# EAGLE design 24ch_amp (EAGLE 6.6.0)
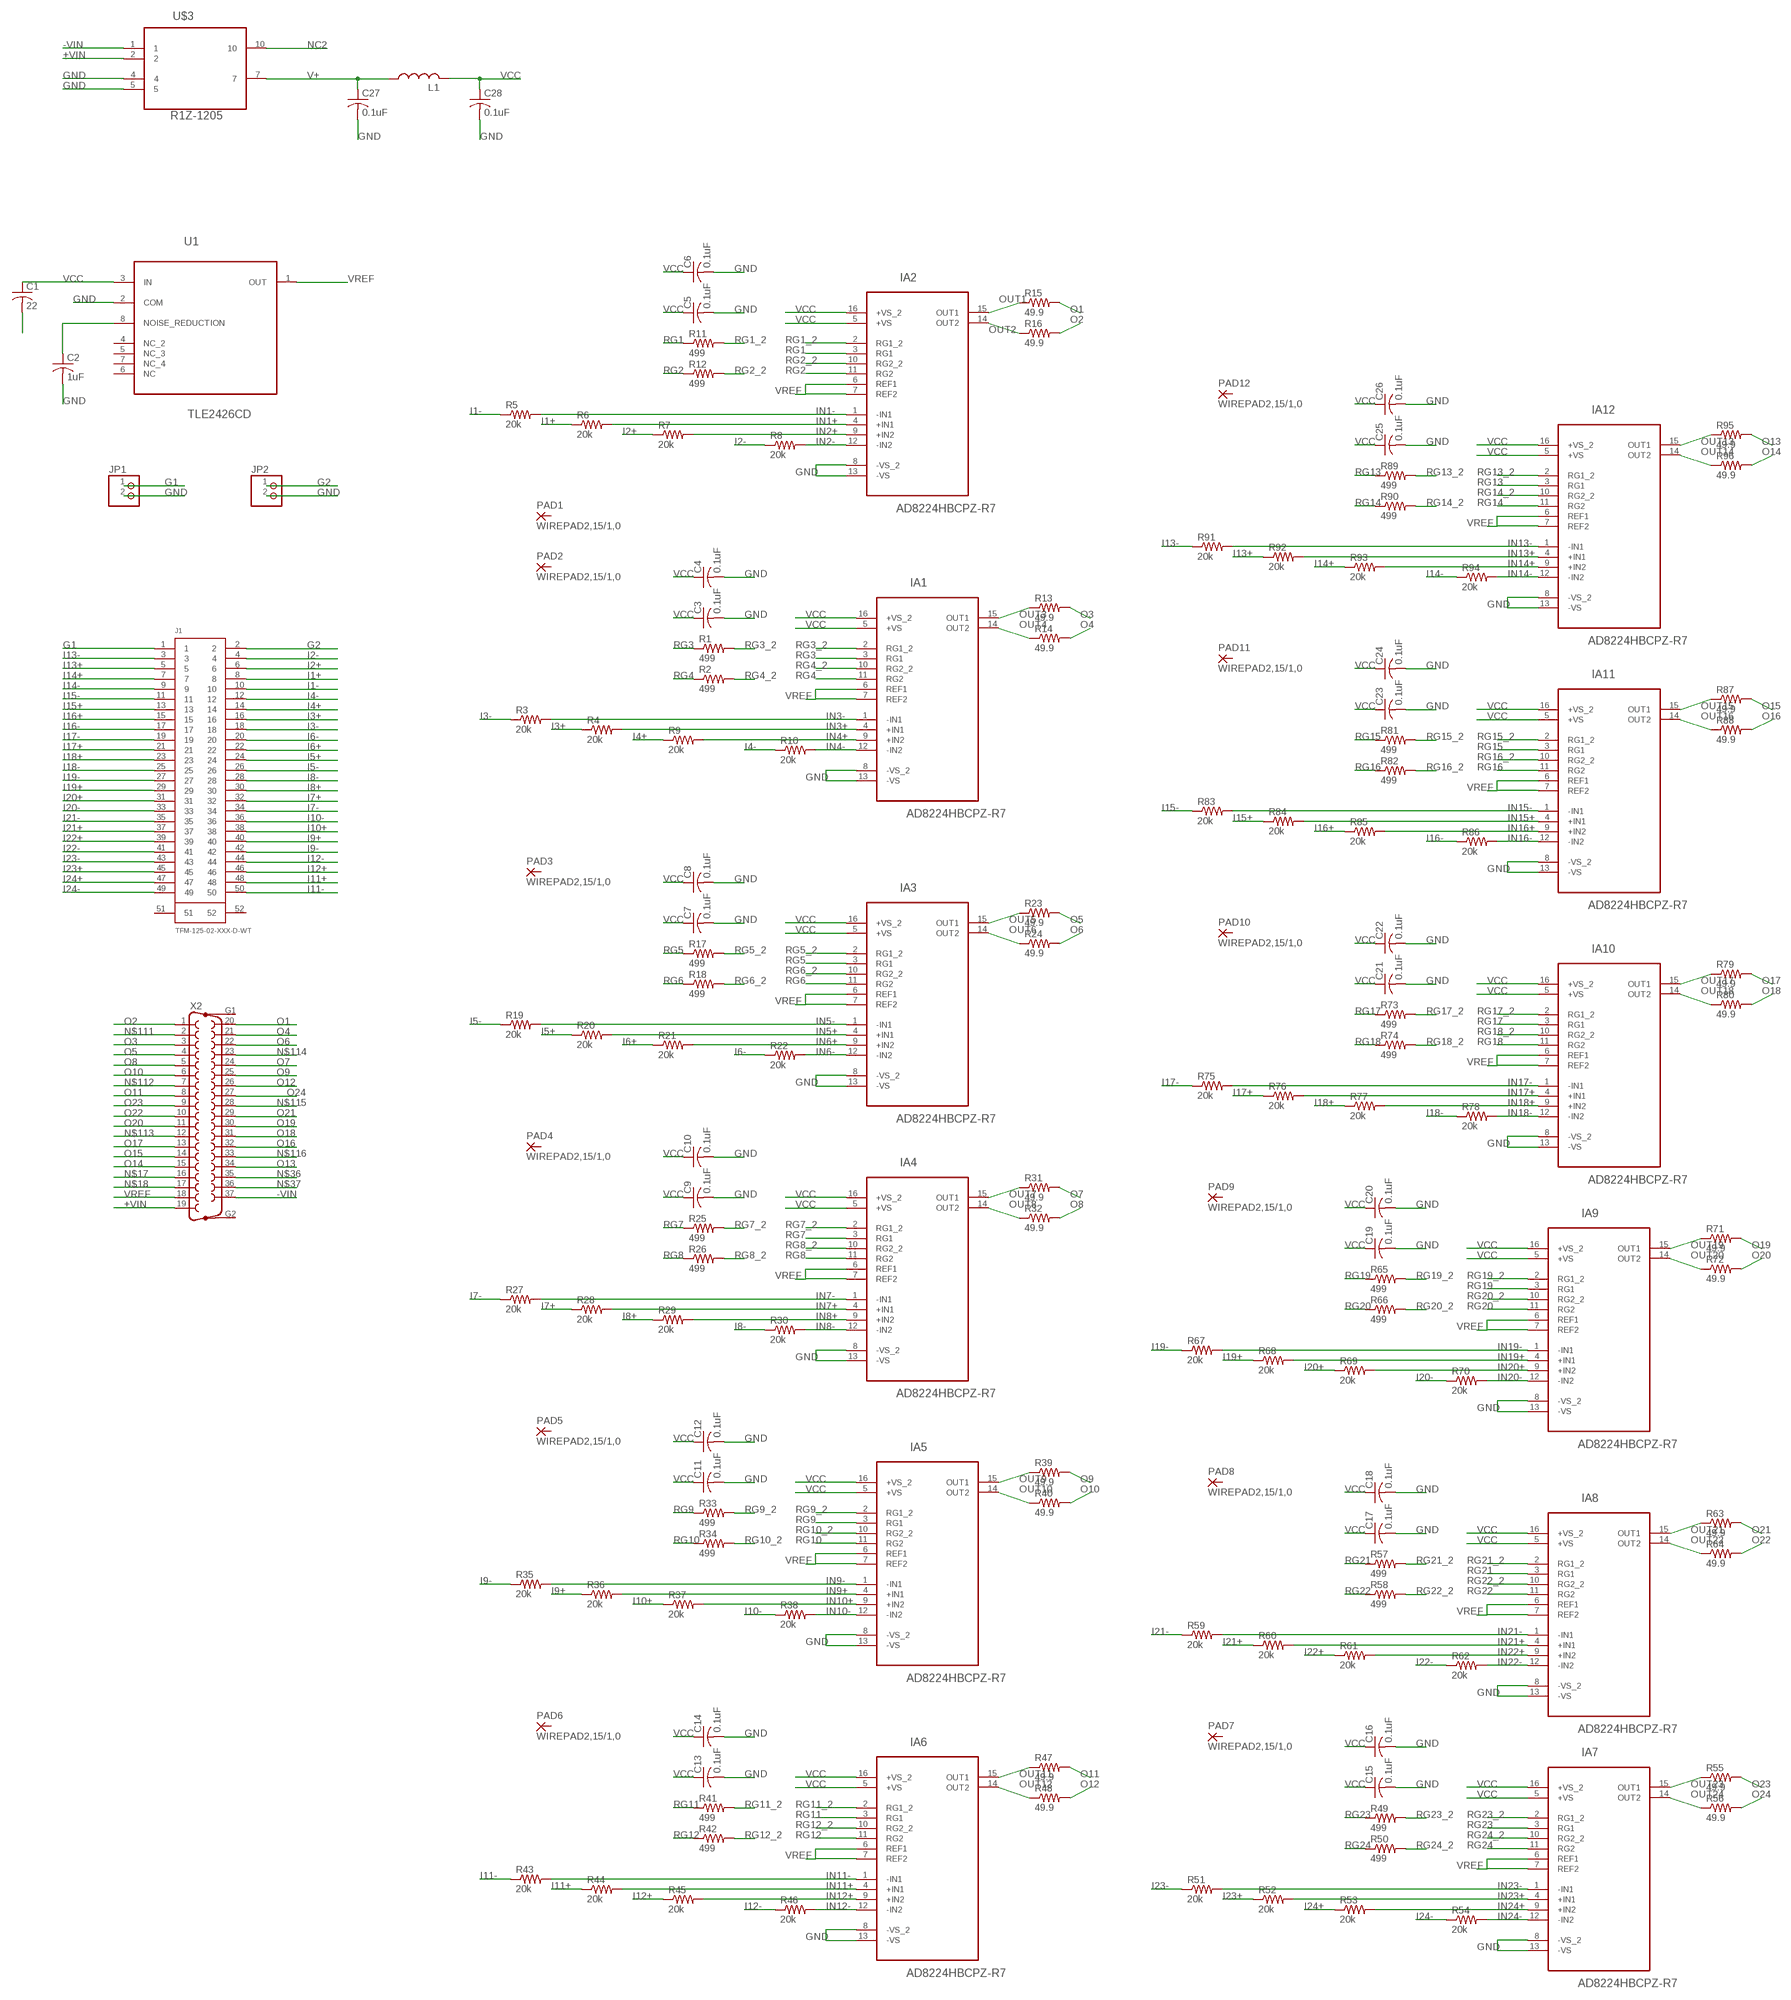
[diagram p0: schematic, sheet 1]

## Parts
C1  22  C-USC0805  [C0805]
C2  1uF  C-USC0805  [C0805]
C3  0.1uF  C-USC0805  [C0805]
C4  0.1uF  C-USC0805  [C0805]
C5  0.1uF  C-USC0805  [C0805]
C6  0.1uF  C-USC0805  [C0805]
C7  0.1uF  C-USC0805  [C0805]
C8  0.1uF  C-USC0805  [C0805]
C9  0.1uF  C-USC0805  [C0805]
C10  0.1uF  C-USC0805  [C0805]
C11  0.1uF  C-USC0805  [C0805]
C12  0.1uF  C-USC0805  [C0805]
C13  0.1uF  C-USC0805  [C0805]
C14  0.1uF  C-USC0805  [C0805]
C15  0.1uF  C-USC0805  [C0805]
C16  0.1uF  C-USC0805  [C0805]
C17  0.1uF  C-USC0805  [C0805]
C18  0.1uF  C-USC0805  [C0805]
C19  0.1uF  C-USC0805  [C0805]
C20  0.1uF  C-USC0805  [C0805]
C21  0.1uF  C-USC0805  [C0805]
C22  0.1uF  C-USC0805  [C0805]
C23  0.1uF  C-USC0805  [C0805]
C24  0.1uF  C-USC0805  [C0805]
C25  0.1uF  C-USC0805  [C0805]
C26  0.1uF  C-USC0805  [C0805]
C27  0.1uF  C-USC0805  [C0805]
C28  0.1uF  C-USC0805  [C0805]
IA1  AD8224HBCPZ-R7  [QFN65P400X400X100-16N]
IA2  AD8224HBCPZ-R7  [QFN65P400X400X100-16N]
IA3  AD8224HBCPZ-R7  [QFN65P400X400X100-16N]
IA4  AD8224HBCPZ-R7  [QFN65P400X400X100-16N]
IA5  AD8224HBCPZ-R7  [QFN65P400X400X100-16N]
IA6  AD8224HBCPZ-R7  [QFN65P400X400X100-16N]
IA7  AD8224HBCPZ-R7  [QFN65P400X400X100-16N]
IA8  AD8224HBCPZ-R7  [QFN65P400X400X100-16N]
IA9  AD8224HBCPZ-R7  [QFN65P400X400X100-16N]
IA10  AD8224HBCPZ-R7  [QFN65P400X400X100-16N]
IA11  AD8224HBCPZ-R7  [QFN65P400X400X100-16N]
IA12  AD8224HBCPZ-R7  [QFN65P400X400X100-16N]
J1  TFM-125-02-XXX-D-WT  [TFM-125-02-XXX-D-WT]
JP1  PINHD-1X2  [1X02]
JP2  PINHD-1X2  [1X02]
L1  L-USL3225M  [L3225M]
PAD1  WIREPAD2,15/1,0  [2,15/1,0]
PAD2  WIREPAD2,15/1,0  [2,15/1,0]
PAD3  WIREPAD2,15/1,0  [2,15/1,0]
PAD4  WIREPAD2,15/1,0  [2,15/1,0]
PAD5  WIREPAD2,15/1,0  [2,15/1,0]
PAD6  WIREPAD2,15/1,0  [2,15/1,0]
PAD7  WIREPAD2,15/1,0  [2,15/1,0]
PAD8  WIREPAD2,15/1,0  [2,15/1,0]
PAD9  WIREPAD2,15/1,0  [2,15/1,0]
PAD10  WIREPAD2,15/1,0  [2,15/1,0]
PAD11  WIREPAD2,15/1,0  [2,15/1,0]
PAD12  WIREPAD2,15/1,0  [2,15/1,0]
R1  499  R-US_R0805  [R0805]
R2  499  R-US_R0805  [R0805]
R3  20k  R-US_R0805  [R0805]
R4  20k  R-US_R0805  [R0805]
R5  20k  R-US_R0805  [R0805]
R6  20k  R-US_R0805  [R0805]
R7  20k  R-US_R0805  [R0805]
R8  20k  R-US_R0805  [R0805]
R9  20k  R-US_R0805  [R0805]
R10  20k  R-US_R0805  [R0805]
R11  499  R-US_R0805  [R0805]
R12  499  R-US_R0805  [R0805]
R13  49.9  R-US_R0805  [R0805]
R14  49.9  R-US_R0805  [R0805]
R15  49.9  R-US_R0805  [R0805]
R16  49.9  R-US_R0805  [R0805]
R17  499  R-US_R0805  [R0805]
R18  499  R-US_R0805  [R0805]
R19  20k  R-US_R0805  [R0805]
R20  20k  R-US_R0805  [R0805]
R21  20k  R-US_R0805  [R0805]
R22  20k  R-US_R0805  [R0805]
R23  49.9  R-US_R0805  [R0805]
R24  49.9  R-US_R0805  [R0805]
R25  499  R-US_R0805  [R0805]
R26  499  R-US_R0805  [R0805]
R27  20k  R-US_R0805  [R0805]
R28  20k  R-US_R0805  [R0805]
R29  20k  R-US_R0805  [R0805]
R30  20k  R-US_R0805  [R0805]
R31  49.9  R-US_R0805  [R0805]
R32  49.9  R-US_R0805  [R0805]
R33  499  R-US_R0805  [R0805]
R34  499  R-US_R0805  [R0805]
R35  20k  R-US_R0805  [R0805]
R36  20k  R-US_R0805  [R0805]
R37  20k  R-US_R0805  [R0805]
R38  20k  R-US_R0805  [R0805]
R39  49.9  R-US_R0805  [R0805]
R40  49.9  R-US_R0805  [R0805]
R41  499  R-US_R0805  [R0805]
R42  499  R-US_R0805  [R0805]
R43  20k  R-US_R0805  [R0805]
R44  20k  R-US_R0805  [R0805]
R45  20k  R-US_R0805  [R0805]
R46  20k  R-US_R0805  [R0805]
R47  49.9  R-US_R0805  [R0805]
R48  49.9  R-US_R0805  [R0805]
R49  499  R-US_R0805  [R0805]
R50  499  R-US_R0805  [R0805]
R51  20k  R-US_R0805  [R0805]
R52  20k  R-US_R0805  [R0805]
R53  20k  R-US_R0805  [R0805]
R54  20k  R-US_R0805  [R0805]
R55  49.9  R-US_R0805  [R0805]
R56  49.9  R-US_R0805  [R0805]
R57  499  R-US_R0805  [R0805]
R58  499  R-US_R0805  [R0805]
R59  20k  R-US_R0805  [R0805]
R60  20k  R-US_R0805  [R0805]
R61  20k  R-US_R0805  [R0805]
R62  20k  R-US_R0805  [R0805]
R63  49.9  R-US_R0805  [R0805]
R64  49.9  R-US_R0805  [R0805]
R65  499  R-US_R0805  [R0805]
R66  499  R-US_R0805  [R0805]
R67  20k  R-US_R0805  [R0805]
R68  20k  R-US_R0805  [R0805]
R69  20k  R-US_R0805  [R0805]
R70  20k  R-US_R0805  [R0805]
R71  49.9  R-US_R0805  [R0805]
R72  49.9  R-US_R0805  [R0805]
R73  499  R-US_R0805  [R0805]
R74  499  R-US_R0805  [R0805]
R75  20k  R-US_R0805  [R0805]
R76  20k  R-US_R0805  [R0805]
R77  20k  R-US_R0805  [R0805]
R78  20k  R-US_R0805  [R0805]
R79  49.9  R-US_R0805  [R0805]
R80  49.9  R-US_R0805  [R0805]
R81  499  R-US_R0805  [R0805]
R82  499  R-US_R0805  [R0805]
R83  20k  R-US_R0805  [R0805]
R84  20k  R-US_R0805  [R0805]
R85  20k  R-US_R0805  [R0805]
R86  20k  R-US_R0805  [R0805]
R87  49.9  R-US_R0805  [R0805]
R88  49.9  R-US_R0805  [R0805]
R89  499  R-US_R0805  [R0805]
R90  499  R-US_R0805  [R0805]
R91  20k  R-US_R0805  [R0805]
R92  20k  R-US_R0805  [R0805]
R93  20k  R-US_R0805  [R0805]
R94  20k  R-US_R0805  [R0805]
R95  49.9  R-US_R0805  [R0805]
R96  49.9  R-US_R0805  [R0805]
U1  TLE2426CD  [SOIC127P600X175-8N]
U$3  R1Z-1205  [R1Z-1205]
X2  F37HP  [F37HP]

## Nets
+VIN: U$3.2 X2.19
-VIN: U$3.1 X2.37
G1: J1.1 JP1.1
G2: J1.2 JP2.1
GND: C1.2 C2.2 C3.2 C4.2 C5.2 C6.2 C7.2 C8.2 C9.2 C10.2 C11.2 C12.2 C13.2 C14.2 C15.2 C16.2 C17.2 C18.2 C19.2 C20.2 C21.2 C22.2 C23.2 C24.2 C25.2 C26.2 C27.2 C28.2 IA1.8(-VS_2) IA1.13(-VS) IA2.8(-VS_2) IA2.13(-VS) IA3.8(-VS_2) IA3.13(-VS) IA4.8(-VS_2) IA4.13(-VS) IA5.8(-VS_2) IA5.13(-VS) IA6.8(-VS_2) IA6.13(-VS) IA7.8(-VS_2) IA7.13(-VS) IA8.8(-VS_2) IA8.13(-VS) IA9.8(-VS_2) IA9.13(-VS) IA10.8(-VS_2) IA10.13(-VS) IA11.8(-VS_2) IA11.13(-VS) IA12.8(-VS_2) IA12.13(-VS) JP1.2 JP2.2 U1.2(COM) U$3.4 U$3.5
I1+: J1.8 R6.1
I1-: J1.10 R5.1
I2+: J1.6 R7.1
I2-: J1.4 R8.1
I3+: J1.16 R4.1
I3-: J1.18 R3.1
I4+: J1.14 R9.1
I4-: J1.12 R10.1
I5+: J1.24 R20.1
I5-: J1.26 R19.1
I6+: J1.22 R21.1
I6-: J1.20 R22.1
I7+: J1.32 R28.1
I7-: J1.34 R27.1
I8+: J1.30 R29.1
I8-: J1.28 R30.1
I9+: J1.40 R36.1
I9-: J1.42 R35.1
I10+: J1.38 R37.1
I10-: J1.36 R38.1
I11+: J1.48 R44.1
I11-: J1.50 R43.1
I12+: J1.46 R45.1
I12-: J1.44 R46.1
I13+: J1.5 R92.1
I13-: J1.3 R91.1
I14+: J1.7 R93.1
I14-: J1.9 R94.1
I15+: J1.13 R84.1
I15-: J1.11 R83.1
I16+: J1.15 R85.1
I16-: J1.17 R86.1
I17+: J1.21 R76.1
I17-: J1.19 R75.1
I18+: J1.23 R77.1
I18-: J1.25 R78.1
I19+: J1.29 R68.1
I19-: J1.27 R67.1
I20+: J1.31 R69.1
I20-: J1.33 R70.1
I21+: J1.37 R60.1
I21-: J1.35 R59.1
I22+: J1.39 R61.1
I22-: J1.41 R62.1
I23+: J1.45 R52.1
I23-: J1.43 R51.1
I24+: J1.47 R53.1
I24-: J1.49 R54.1
IN1+: IA2.4(+IN1) R6.2
IN1-: IA2.1(-IN1) R5.2
IN2+: IA2.9(+IN2) R7.2
IN2-: IA2.12(-IN2) R8.2
IN3+: IA1.4(+IN1) R4.2
IN3-: IA1.1(-IN1) R3.2
IN4+: IA1.9(+IN2) R9.2
IN4-: IA1.12(-IN2) R10.2
IN5+: IA3.4(+IN1) R20.2
IN5-: IA3.1(-IN1) R19.2
IN6+: IA3.9(+IN2) R21.2
IN6-: IA3.12(-IN2) R22.2
IN7+: IA4.4(+IN1) R28.2
IN7-: IA4.1(-IN1) R27.2
IN8+: IA4.9(+IN2) R29.2
IN8-: IA4.12(-IN2) R30.2
IN9+: IA5.4(+IN1) R36.2
IN9-: IA5.1(-IN1) R35.2
IN10+: IA5.9(+IN2) R37.2
IN10-: IA5.12(-IN2) R38.2
IN11+: IA6.4(+IN1) R44.2
IN11-: IA6.1(-IN1) R43.2
IN12+: IA6.9(+IN2) R45.2
IN12-: IA6.12(-IN2) R46.2
IN13+: IA12.4(+IN1) R92.2
IN13-: IA12.1(-IN1) R91.2
IN14+: IA12.9(+IN2) R93.2
IN14-: IA12.12(-IN2) R94.2
IN15+: IA11.4(+IN1) R84.2
IN15-: IA11.1(-IN1) R83.2
IN16+: IA11.9(+IN2) R85.2
IN16-: IA11.12(-IN2) R86.2
IN17+: IA10.4(+IN1) R76.2
IN17-: IA10.1(-IN1) R75.2
IN18+: IA10.9(+IN2) R77.2
IN18-: IA10.12(-IN2) R78.2
IN19+: IA9.4(+IN1) R68.2
IN19-: IA9.1(-IN1) R67.2
IN20+: IA9.9(+IN2) R69.2
IN20-: IA9.12(-IN2) R70.2
IN21+: IA8.4(+IN1) R60.2
IN21-: IA8.1(-IN1) R59.2
IN22+: IA8.9(+IN2) R61.2
IN22-: IA8.12(-IN2) R62.2
IN23+: IA7.4(+IN1) R52.2
IN23-: IA7.1(-IN1) R51.2
IN24+: IA7.9(+IN2) R53.2
IN24-: IA7.12(-IN2) R54.2
N$2: C2.1 U1.8(NOISE_REDUCTION)
N$17: X2.16
N$18: X2.17
N$36: X2.35
N$37: X2.36
N$111: X2.2
N$112: X2.7
N$113: X2.12
N$114: X2.23
N$115: X2.28
N$116: X2.33
NC2: U$3.10
O1: R15.2 X2.20
O2: R16.2 X2.1
O3: R13.2 X2.3
O4: R14.2 X2.21
O5: R23.2 X2.4
O6: R24.2 X2.22
O7: R31.2 X2.24
O8: R32.2 X2.5
O9: R39.2 X2.25
O10: R40.2 X2.6
O11: R47.2 X2.8
O12: R48.2 X2.26
O13: R95.2 X2.34
O14: R96.2 X2.15
O15: R87.2 X2.14
O16: R88.2 X2.32
O17: R79.2 X2.13
O18: R80.2 X2.31
O19: R71.2 X2.30
O20: R72.2 X2.11
O21: R63.2 X2.29
O22: R64.2 X2.10
O23: R55.2 X2.9
O24: R56.2 X2.27
OUT1: IA2.15(OUT1) R15.1
OUT2: IA2.14(OUT2) R16.1
OUT3: IA1.15(OUT1) R13.1
OUT4: IA1.14(OUT2) R14.1
OUT5: IA3.15(OUT1) R23.1
OUT6: IA3.14(OUT2) R24.1
OUT7: IA4.15(OUT1) R31.1
OUT8: IA4.14(OUT2) R32.1
OUT9: IA5.15(OUT1) R39.1
OUT10: IA5.14(OUT2) R40.1
OUT11: IA6.15(OUT1) R47.1
OUT12: IA6.14(OUT2) R48.1
OUT13: IA12.15(OUT1) R95.1
OUT14: IA12.14(OUT2) R96.1
OUT15: IA11.15(OUT1) R87.1
OUT16: IA11.14(OUT2) R88.1
OUT17: IA10.15(OUT1) R79.1
OUT18: IA10.14(OUT2) R80.1
OUT19: IA9.15(OUT1) R71.1
OUT20: IA9.14(OUT2) R72.1
OUT21: IA8.15(OUT1) R63.1
OUT22: IA8.14(OUT2) R64.1
OUT23: IA7.15(OUT1) R55.1
OUT24: IA7.14(OUT2) R56.1
RG1: IA2.3(RG1) R11.1
RG1_2: IA2.2(RG1_2) R11.2
RG2: IA2.11(RG2) R12.1
RG2_2: IA2.10(RG2_2) R12.2
RG3: IA1.3(RG1) R1.1
RG3_2: IA1.2(RG1_2) R1.2
RG4: IA1.11(RG2) R2.1
RG4_2: IA1.10(RG2_2) R2.2
RG5: IA3.3(RG1) R17.1
RG5_2: IA3.2(RG1_2) R17.2
RG6: IA3.11(RG2) R18.1
RG6_2: IA3.10(RG2_2) R18.2
RG7: IA4.3(RG1) R25.1
RG7_2: IA4.2(RG1_2) R25.2
RG8: IA4.11(RG2) R26.1
RG8_2: IA4.10(RG2_2) R26.2
RG9: IA5.3(RG1) R33.1
RG9_2: IA5.2(RG1_2) R33.2
RG10: IA5.11(RG2) R34.1
RG10_2: IA5.10(RG2_2) R34.2
RG11: IA6.3(RG1) R41.1
RG11_2: IA6.2(RG1_2) R41.2
RG12: IA6.11(RG2) R42.1
RG12_2: IA6.10(RG2_2) R42.2
RG13: IA12.3(RG1) R89.1
RG13_2: IA12.2(RG1_2) R89.2
RG14: IA12.11(RG2) R90.1
RG14_2: IA12.10(RG2_2) R90.2
RG15: IA11.3(RG1) R81.1
RG15_2: IA11.2(RG1_2) R81.2
RG16: IA11.11(RG2) R82.1
RG16_2: IA11.10(RG2_2) R82.2
RG17: IA10.3(RG1) R73.1
RG17_2: IA10.2(RG1_2) R73.2
RG18: IA10.11(RG2) R74.1
RG18_2: IA10.10(RG2_2) R74.2
RG19: IA9.3(RG1) R65.1
RG19_2: IA9.2(RG1_2) R65.2
RG20: IA9.11(RG2) R66.1
RG20_2: IA9.10(RG2_2) R66.2
RG21: IA8.3(RG1) R57.1
RG21_2: IA8.2(RG1_2) R57.2
RG22: IA8.11(RG2) R58.1
RG22_2: IA8.10(RG2_2) R58.2
RG23: IA7.3(RG1) R49.1
RG23_2: IA7.2(RG1_2) R49.2
RG24: IA7.11(RG2) R50.1
RG24_2: IA7.10(RG2_2) R50.2
V+: C27.1 L1.1 U$3.7
VCC: C1.1 C3.1 C4.1 C5.1 C6.1 C7.1 C8.1 C9.1 C10.1 C11.1 C12.1 C13.1 C14.1 C15.1 C16.1 C17.1 C18.1 C19.1 C20.1 C21.1 C22.1 C23.1 C24.1 C25.1 C26.1 C28.1 IA1.5(+VS) IA1.16(+VS_2) IA2.5(+VS) IA2.16(+VS_2) IA3.5(+VS) IA3.16(+VS_2) IA4.5(+VS) IA4.16(+VS_2) IA5.5(+VS) IA5.16(+VS_2) IA6.5(+VS) IA6.16(+VS_2) IA7.5(+VS) IA7.16(+VS_2) IA8.5(+VS) IA8.16(+VS_2) IA9.5(+VS) IA9.16(+VS_2) IA10.5(+VS) IA10.16(+VS_2) IA11.5(+VS) IA11.16(+VS_2) IA12.5(+VS) IA12.16(+VS_2) L1.2 U1.3(IN)
VREF: IA1.6(REF1) IA1.7(REF2) IA2.6(REF1) IA2.7(REF2) IA3.6(REF1) IA3.7(REF2) IA4.6(REF1) IA4.7(REF2) IA5.6(REF1) IA5.7(REF2) IA6.6(REF1) IA6.7(REF2) IA7.6(REF1) IA7.7(REF2) IA8.6(REF1) IA8.7(REF2) IA9.6(REF1) IA9.7(REF2) IA10.6(REF1) IA10.7(REF2) IA11.6(REF1) IA11.7(REF2) IA12.6(REF1) IA12.7(REF2) U1.1(OUT) X2.18
Unconnected: J1.51 J1.52 PAD1.1(P) PAD2.1(P) PAD3.1(P) PAD4.1(P) PAD5.1(P) PAD6.1(P) PAD7.1(P) PAD8.1(P) PAD9.1(P) PAD10.1(P) PAD11.1(P) PAD12.1(P) U1.4(NC_2) U1.5(NC_3) U1.6(NC) U1.7(NC_4) X2.G1 X2.G2

## Library data of the parts
C1-C28 = rcl:C-US: CAPACITOR, American symbol
IA1-IA12 = Analog Devices_By_element14_Batch1:AD8224HBCPZ-R7: Precision, Dual-Channel, JFET Input,Rail-to-Rail Instrumentation Amplifier; MPN: AD8224HBCPZ-R7; OC_FARNELL: -; OC_NEWARK: 79R2339; PACKAGE: QFN-16; SUPPLIER: Analog Devices
J1 = TFM-125-02-XXX-D-WT:TFM-125-02-XXX-D-WT: 0.050"X0.050" SURFACE MOUNT TERMINAL STRIP WITH DUAL WELD TAB.
JP1 JP2 = pinhead:PINHD-1X2: PIN HEADER
L1 = resistor:L-US: INDUCTOR, American symbol
PAD1-PAD12 = wirepad:WIREPAD: Wire PAD connect wire on PCB
R1-R96 = rcl:R-US_: RESISTOR, American symbol
U1 = Texas Instruments_By_element14_Batch_1:TLE2426CD: PRECISION VIRTUAL GROUND; MPN: TLE2426CD; OC_FARNELL: 8454809; OC_NEWARK: 50B7917; PACKAGE: SOIC-8; SUPPLIER: Texas Instruments
U$3 = tuckerLib:R1Z-1205
X2 = con-subd:F37HP: SUB-D; OC_FARNELL: unknown; OC_NEWARK: unknown

## Board
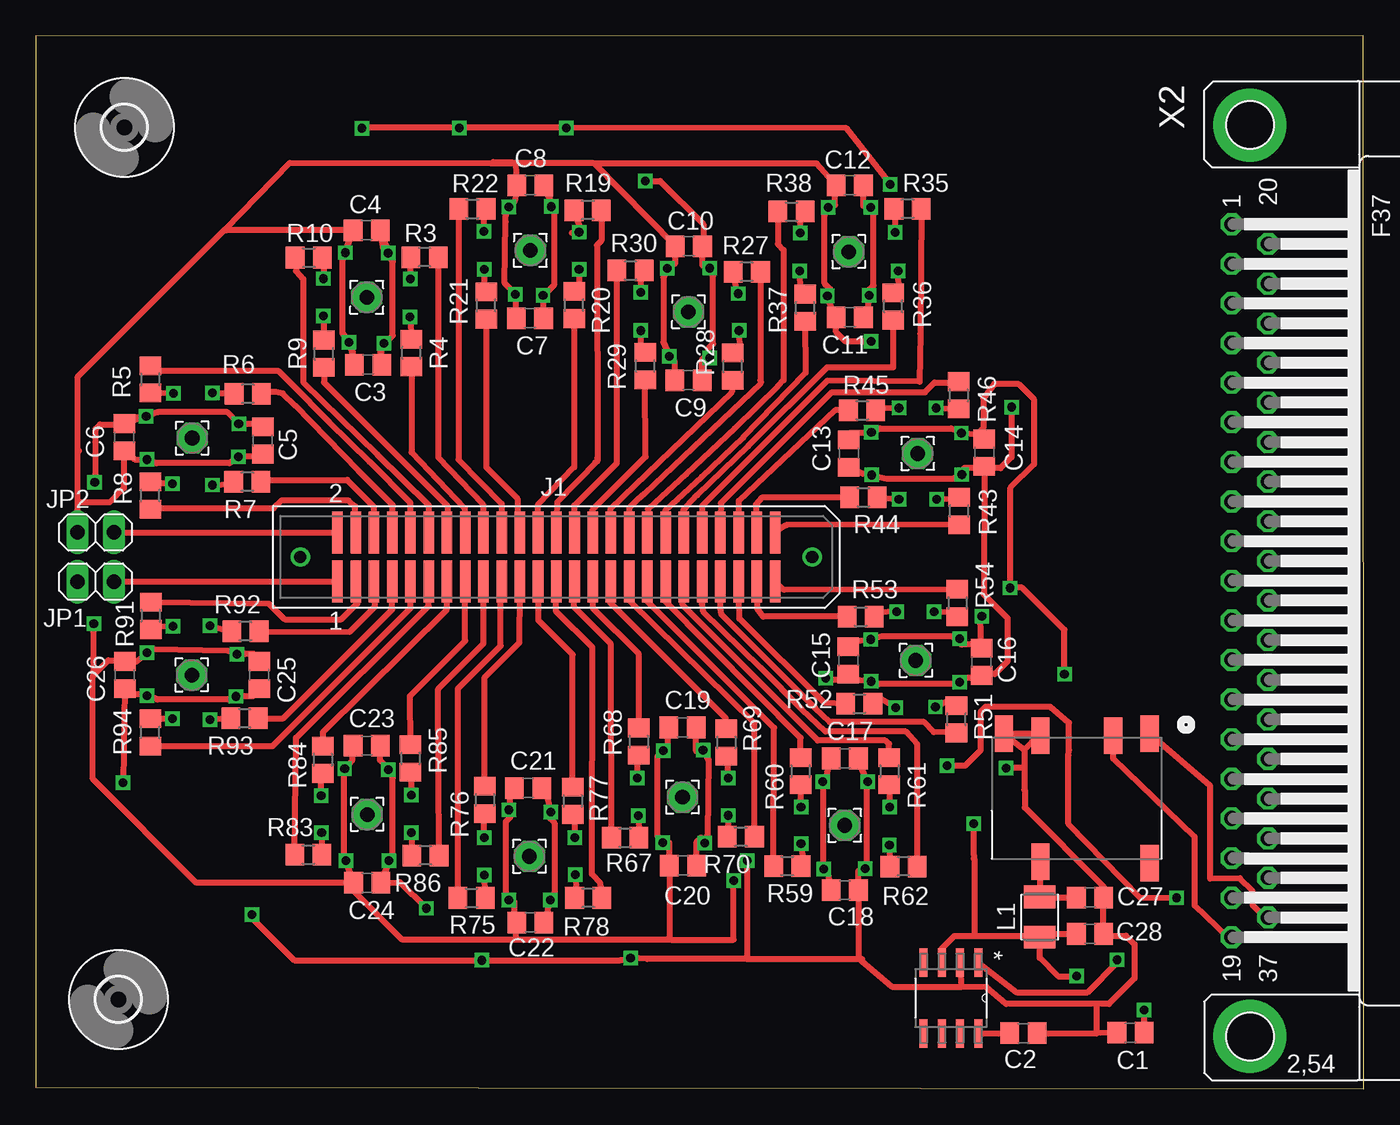
[diagram p1: board, top side]
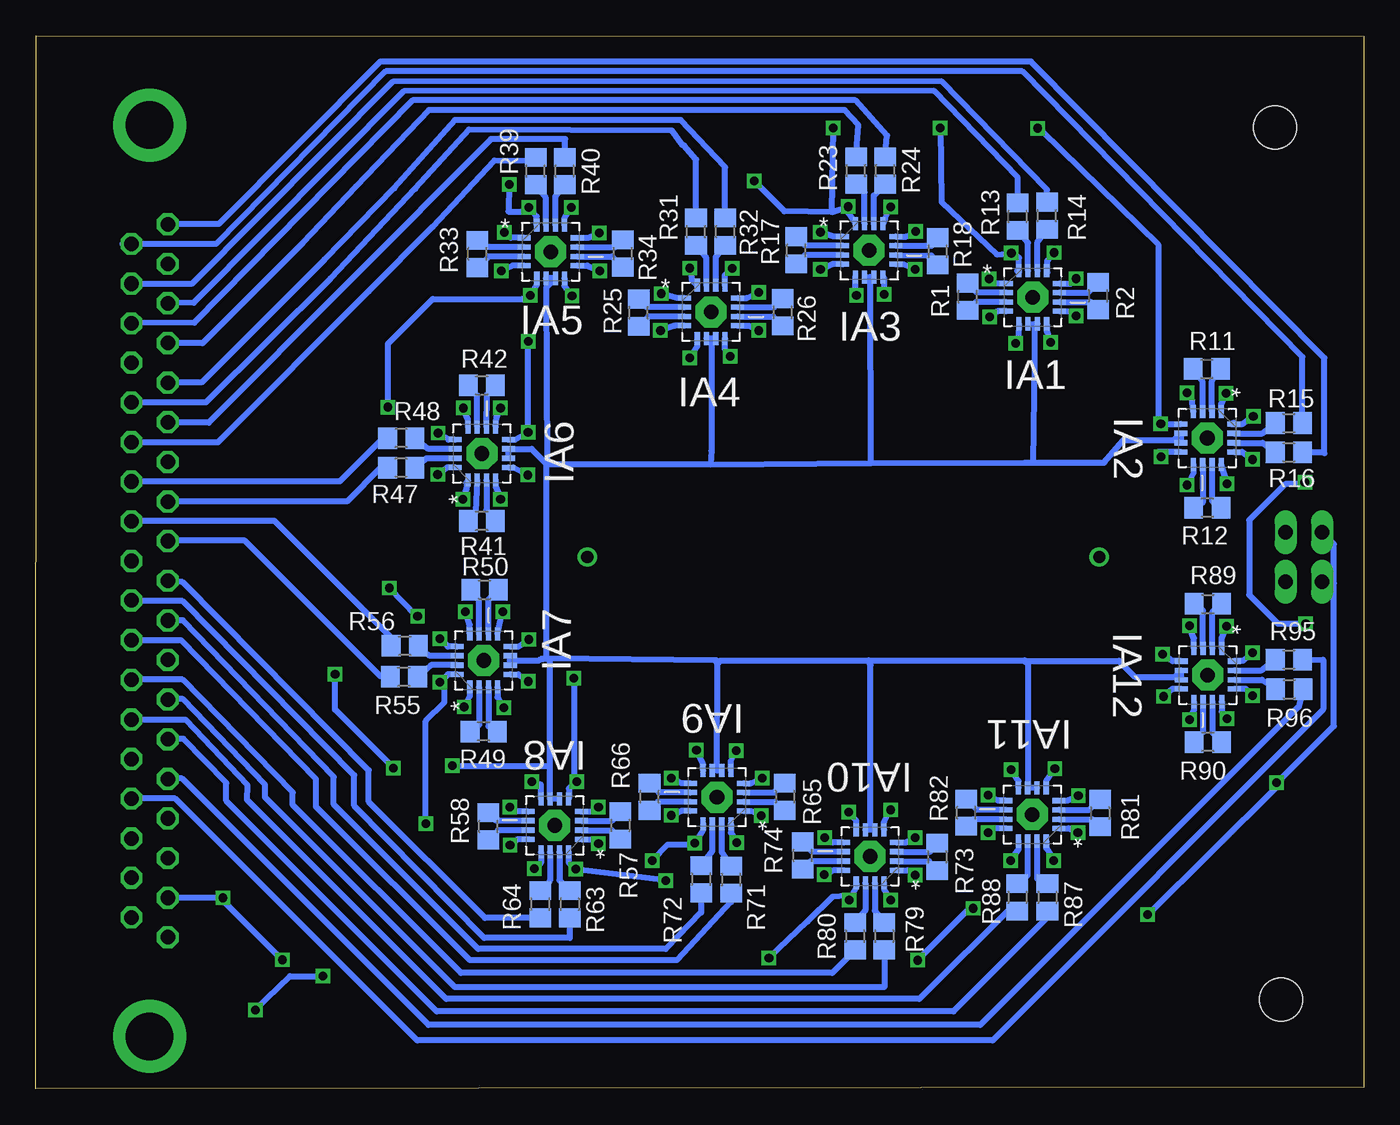
[diagram p2: board, bottom side, seen from below]

Size 92.51 x 73.36 mm. Coordinates in mm from the lower left corner, seen from the top.
Outline: 0,0.1 92.51,0 92.47,73.36 0,73.33 0,0.1
Copper layers (1*16): Top 0.035mm / dielectric 1.5mm / Bottom 0.035mm
Design rules "default *": minimum track width 10mil, minimum drill 10mil, track to track 8mil, track to pad 8mil, pad to pad 8mil, via to via 8mil, smd to smd 8mil, copper to edge 40mil, drill to drill 8mil, minimum pad ring 10mil, minimum via ring 8mil, stop-mask expansion 4mil, vias tented up to drill 0mil, thermal gap 10mil

### Footprints (pad centres in the part's own frame; a part is rotated, then mirrored left to right if it is on the bottom)
C0805 = smd 1.3 x 1.5: 1 -0.95,0; 2 0.95,0
QFN65P400X400X100-16N = smd 0.914 x 0.356: 1 -1.854,0.965; 2 -1.854,0.33; 3 -1.854,-0.33; 4 -1.854,-0.965; 9 1.854,-0.965; 10 1.854,-0.33; 11 1.854,0.33; 12 1.854,0.965 | smd 0.356 x 0.914: 5 -0.965,-1.854; 6 -0.33,-1.854; 7 0.33,-1.854; 8 0.965,-1.854; 13 0.965,1.854; 14 0.33,1.854; 15 -0.33,1.854; 16 -0.965,1.854
TFM-125-02-XXX-D-WT = smd 0.737 x 2.921: 1 -15.24,-1.714; 2 -15.24,1.714; 3 -13.97,-1.714; 4 -13.97,1.714; 5 -12.7,-1.714; 6 -12.7,1.714; 7 -11.43,-1.714; 8 -11.43,1.714; 9 -10.16,-1.714; 10 -10.16,1.714; 11 -8.89,-1.714; 12 -8.89,1.714; 13 -7.62,-1.714; 14 -7.62,1.714; 15 -6.35,-1.714; 16 -6.35,1.714; 17 -5.08,-1.714; 18 -5.08,1.714; 19 -3.81,-1.714; 20 -3.81,1.714; 21 -2.54,-1.714; 22 -2.54,1.714; 23 -1.27,-1.714; 24 -1.27,1.714; 25 0,-1.714; 26 0,1.714; 27 1.27,-1.714; 28 1.27,1.714; 29 2.54,-1.714; 30 2.54,1.714; 31 3.81,-1.714; 32 3.81,1.714; 33 5.08,-1.714; 34 5.08,1.714; 35 6.35,-1.714; 36 6.35,1.714; 37 7.62,-1.714; 38 7.62,1.714; 39 8.89,-1.714; 40 8.89,1.714; 41 10.16,-1.714; 42 10.16,1.714; 43 11.43,-1.714; 44 11.43,1.714; 45 12.7,-1.714; 46 12.7,1.714; 47 13.97,-1.714; 48 13.97,1.714; 49 15.24,-1.714; 50 15.24,1.714 | drill 0.838: 51 -17.831,0; 52 17.831,0
1X02 = drill 1.016 long: 1 -1.27,0; 2 1.27,0
L3225M = smd 1.6 x 2.2: 1 -1.4,0; 2 1.4,0
2,15/1,0 = drill 1.016 pad 2.159 octagon: 1 0,0
R0805 = smd 1.3 x 1.5: 1 -0.95,0; 2 0.95,0
SOIC127P600X175-8N = smd 1.981 x 0.559: 1 -2.464,1.905; 2 -2.464,0.635; 3 -2.464,-0.635; 4 -2.464,-1.905; 5 2.464,-1.905; 6 2.464,-0.635; 7 2.464,0.635; 8 2.464,1.905
3,0 = hole 3: 0,0
R1Z-1205 = smd 1.27 x 2.54: 1 -5.08,-5.207; 2 -2.54,-5.08; 4 2.54,-5.08; 5 5.08,-5.207; 7 2.54,3.683; 10 -5.08,3.81
F37HP = drill 1.016 octagon: 1 -24.841,-1.27; 2 -22.073,-1.27; 3 -19.329,-1.27; 4 -16.561,-1.27; 5 -13.792,-1.27; 6 -11.049,-1.27; 7 -8.28,-1.27; 8 -5.512,-1.27; 9 -2.769,-1.27; 10 0,-1.27; 11 2.769,-1.27; 12 5.512,-1.27; 13 8.28,-1.27; 14 11.049,-1.27; 15 13.818,-1.27; 16 16.561,-1.27; 17 19.329,-1.27; 18 22.098,-1.27; 19 24.841,-1.27; 20 -23.47,1.27; 21 -20.701,1.27; 22 -17.932,1.27; 23 -15.189,1.27; 24 -12.421,1.27; 25 -9.652,1.27; 26 -6.909,1.27; 27 -4.14,1.27; 28 -1.372,1.27; 29 1.372,1.27; 30 4.14,1.27; 31 6.909,1.27; 32 9.677,1.27; 33 12.421,1.27; 34 15.189,1.27; 35 17.958,1.27; 36 20.701,1.27; 37 23.47,1.27 | drill 3.302 pad 5.08: G1 -31.75,0; G2 31.75,0

### Placement (x,y rotation side)
C1  76.26,3.91 180 top
C2  68.8,3.87 0 top
C3  23.15,50.45 180 top
C4  23.05,59.82 180 top
C5  15.81,45.18 270 top
C6  6.16,45.4 270 top
C7  34.42,53.69 180 top
C8  34.45,62.96 180 top
C9  45.47,49.37 180 top
C10  45.5,58.71 180 top
C11  56.71,53.75 180 top
C12  56.71,62.96 180 top
C13  56.64,44.26 90 top
C14  66.07,44.32 90 top
C15  56.61,29.84 90 top
C16  65.88,29.75 90 top
C17  56.36,23.02 0 top
C18  56.36,13.84 0 top
C19  45.05,25.18 0 top
C20  45.09,15.56 0 top
C21  34.29,20.95 0 top
C22  34.45,11.59 0 top
C23  23.05,23.91 0 top
C24  23.08,14.35 0 top
C25  15.56,28.83 270 top
C26  6.19,28.83 270 top
C27  73.44,13.34 0 top
C28  73.44,10.79 0 top
IA1  23.05,55.15 0 bottom
IA2  10.89,45.34 270 bottom
IA3  34.45,58.42 0 bottom
IA4  45.47,54.13 0 bottom
IA5  56.64,58.32 0 bottom
IA6  61.44,44.26 90 bottom
IA7  61.31,29.84 90 bottom
IA8  56.36,18.35 180 bottom
IA9  45.05,20.32 180 bottom
IA10  34.39,16.19 180 bottom
IA11  23.08,19.11 180 bottom
IA12  10.86,28.83 270 bottom
J1  36.26,37.05 0 top
JP1  4.16,35.34 180 top
JP2  4.16,38.77 180 top
L1  69.95,11.97 270 top
PAD1  23.05,55.15 270 top
PAD2  10.89,45.34 180 top
PAD3  34.45,58.42 270 top
PAD4  45.47,54.13 270 top
PAD5  56.64,58.32 0 top
PAD6  61.44,44.26 0 top
PAD7  61.31,29.84 0 top
PAD8  56.36,18.35 0 top
PAD9  45.05,20.32 0 top
PAD10  34.39,16.19 0 top
PAD11  23.08,19.11 0 top
PAD12  10.86,28.83 0 top
R1  27.59,55.18 90 bottom
R2  18.51,55.25 270 bottom
R3  27.08,57.94 180 top
R4  26.16,51.28 90 top
R5  7.97,49.43 270 top
R6  14.76,48.42 180 top
R7  14.73,42.29 180 top
R8  7.97,41.34 90 top
R9  20.07,51.21 90 top
R10  19.02,57.91 0 top
R11  10.92,50.16 0 bottom
R12  10.89,40.48 180 bottom
R13  24.1,60.77 90 bottom
R14  22.07,60.83 90 bottom
R15  5.21,46.39 0 bottom
R16  5.21,44.35 0 bottom
R17  39.53,58.42 90 bottom
R18  29.69,58.36 270 bottom
R19  38.45,61.21 180 top
R20  37.5,54.61 90 top
R21  31.37,54.58 90 top
R22  30.42,61.31 0 top
R23  35.37,63.98 90 bottom
R24  33.34,63.98 90 bottom
R25  50.51,54.07 90 bottom
R26  40.48,54.1 270 bottom
R27  49.53,56.93 180 top
R28  48.55,50.32 90 top
R29  42.45,50.36 90 top
R30  41.43,57.02 0 top
R31  46.51,59.72 90 bottom
R32  44.48,59.72 90 bottom
R33  61.75,58.17 90 bottom
R34  51.63,58.2 270 bottom
R35  60.74,61.31 180 top
R36  59.72,54.51 90 top
R37  53.59,54.42 90 top
R38  52.64,61.12 0 top
R39  57.69,63.94 90 bottom
R40  55.66,63.94 90 bottom
R41  61.44,39.56 180 bottom
R42  61.44,49.02 0 bottom
R43  64.33,40.26 90 top
R44  57.66,41.21 0 top
R45  57.56,47.28 0 top
R46  64.29,48.32 270 top
R47  67.06,43.28 180 bottom
R48  67.06,45.34 180 bottom
R49  61.31,24.89 180 bottom
R50  61.25,34.77 0 bottom
R51  64.14,25.75 90 top
R52  57.37,26.83 0 top
R53  57.47,32.89 0 top
R54  64.2,33.85 270 top
R55  66.87,28.7 180 bottom
R56  66.8,30.86 180 bottom
R57  51.78,18.35 270 bottom
R58  60.99,18.29 90 bottom
R59  52.36,15.53 0 top
R60  53.28,22.13 270 top
R61  59.47,22.13 270 top
R62  60.45,15.49 180 top
R63  55.31,12.86 270 bottom
R64  57.37,12.86 270 bottom
R65  40.32,20.35 270 bottom
R66  49.75,20.35 90 bottom
R67  41.05,17.49 0 top
R68  42.01,24.19 270 top
R69  48.1,24.13 270 top
R70  49.12,17.56 180 top
R71  44.07,14.57 270 bottom
R72  46.16,14.61 270 bottom
R73  29.72,16.16 270 bottom
R74  39.08,16.26 90 bottom
R75  30.35,13.3 0 top
R76  31.27,20.13 270 top
R77  37.4,20.07 270 top
R78  38.48,13.3 180 top
R79  33.4,10.64 270 bottom
R80  35.43,10.64 270 bottom
R81  18.35,19.21 270 bottom
R82  27.69,19.24 90 bottom
R83  18.99,16.32 0 top
R84  20,22.92 270 top
R85  26.1,23.02 270 top
R86  27.15,16.26 180 top
R87  22.03,13.34 270 bottom
R88  24.13,13.34 270 bottom
R89  10.86,33.78 0 bottom
R90  10.86,24.16 180 bottom
R91  8,32.96 270 top
R92  14.61,31.88 180 top
R93  14.54,25.81 180 top
R94  7.97,24.83 90 top
R95  5.21,29.91 0 bottom
R96  5.18,27.84 0 bottom
U1  63.75,6.32 270 top
U$1  [3,0]  5.75,6.22 0 top
U$2  [3,0]  6.16,66.99 0 top
U$3  72.52,19.53 180 top
X2  84.58,35.4 270 top

### Tracks (layer width: path | path; a pad name or v marks a point on that pad's centre or on a via)
+VIN
  Top 0.406: X2.19 83.07,10.56 80.74,12.76 80.74,17.56 75.06,23.02 U$3.2
-VIN
  Top 0.406: X2.37 85.64,11.93 84.77,12.8 84.77,13.78 83.88,14.67 81.82,14.64 81.82,21.11 U$3.1
G1
  Top 0.406: JP1.1 J1.1
G2
  Top 0.406: JP2.1 J1.2
GND  (via drill 0.6)
  Top 0.406: C4.2 21.37,57.75 21.37,52.64 21.94,51.91 C3.2 22.03,51.46 v21.81,52.01 | v21.56,58.26 C4.2 | v32.96,61.44 33.18,61.21 33.18,61.47 33.37,61.91 C8.2 33.42,64.5 | C7.2 33.47,55.27 | 33.47,55.27 v33.4,55.34 | 33.47,55.27 33.47,55.34 32.67,56.13 32.73,60.42 32.73,60.83 v32.96,61.44 | v32.96,61.44 33.12,61.4 | 33.24,64.52 31.88,64.58 | C9.2 44.52,50.64 v44.13,51.02 43.72,52.01 43.72,56.55 v43.99,57.17 44.52,57.47 C10.2 38.89,64.49 | 33.24,64.52 33.42,64.5 | 33.24,64.52 38.77,64.52 38.89,64.49 | 38.89,64.49 54.39,64.49 C12.2 55.69,62.89 55.69,61.59 v55.21,61.4 54.96,60.86 54.96,56.1 55.34,55.72 v55.15,55.24 55.47,54.23 C11.2 55.75,53.95 55.75,52.74 56.42,52.07 v58.2,52.07 | 65.59,45.62 v64.48,45.69 63.79,46.01 58.83,46.01 v58.21,45.74 56.73,45.72 C13.2 | 65.59,45.62 C14.2 | C15.2 56.96,31.15 v58.17,31.31 58.93,31.53 63.85,31.53 64.17,31.21 v64.36,31.37 64.48,30.96 65.44,30.96 65.69,30.7 C16.2 65.82,32.8 v65.91,32.92 | v67.88,34.89 67.91,41.88 69.56,43.53 69.56,48.01 68.48,49.09 66.77,49.12 66.01,48.1 66.01,46.04 65.59,45.62 | C17.2 57.28,22.95 57.78,21.72 v57.94,21.4 57.66,21.34 57.91,21.15 57.91,15.75 57.63,15.46 v57.78,15.33 57.31,15.17 C18.2 57.34,13.9 57.34,9.05 | C20.2 46.03,17.21 46.32,17.49 46.61,16.92 v46.59,17.13 46.8,17.72 46.86,22.92 v46.48,23.59 46.01,23.53 46.01,24.64 C19.2 | v49.56,15.91 49.53,9.05 | 49.53,9.05 57.34,9.05 | 57.56,9.05 57.34,9.05 | C21.2 35.62,20.51 v35.88,19.27 35.69,18.95 36.13,18.51 36.13,13.65 v35.85,13.14 35.72,12.92 35.59,12 C22.2 | 49.53,9.05 42.61,9.05 v41.43,9.11 40.7,8.95 v31.08,8.95 18,8.95 15.05,11.91 v15.05,12.13
  Top 0.406: v24.56,22.24 24.86,21.65 24.86,16.1 v24.61,15.91 24.29,15.05 C24.2 25.37,14.38 v27.21,12.57 | v24.56,22.24 24.45,22.07 24.48,22.35 | 24.48,22.35 23.97,22.89 24,23.75 C23.2 | v24.56,22.24 24.59,22.24 24.48,22.35 | C25.2 15.12,27.34 v13.94,27.34 13.75,27.4 13.46,27.11 8.48,27.11 v7.75,27.4 7.52,27.5 6.8,27.53 C26.2 6.1,21.34 v6.06,21.34 | 57.34,9.05 59.63,7.11 64.52,7.11 | JP2.2 2.92,38.8 2.92,40.86 | v7.75,43.85 7.91,43.79 8.42,43.59 13.49,43.59 v14.1,44.04 15.62,44.04 C5.2 | 2.92,40.86 2.92,44.35 | 2.92,44.35 2.92,49.62 13.19,59.9 | 13.19,59.9 17.68,64.52 31.69,64.48 33.42,64.5 | C4.2 13.27,59.82 13.19,59.9 | v7.75,43.85 6.89,43.85 6.28,44.45 C6.2 6.13,44.42 6.13,41.85 5.14,40.86 2.92,40.86 | 7.94,43.85 v7.75,43.85 | 3.02,44.45 2.92,44.35 | U$3.4 70.04,24.73 U$3.5 68.87,23.62 | 64.52,7.11 U1.2 | 69.85,24.61 68.87,23.62 | 68.87,23.62 68.87,22.29 | 68.87,22.29 68.87,20.86 | 68.87,20.86 68.87,20.83 | 73.91,5.91 74.77,5.91 76.55,7.68 76.55,10.06 75.95,10.67 74.51,10.67 C28.2 C27.2 | 73.91,5.91 67.6,5.91 66.23,7.08 64.52,7.11 | C2.2 73.95,3.87 | 73.95,3.87 73.91,3.94 73.91,5.91 | C27.2 74.55,13.49 | C1.2 75,3.9 73.95,3.87 | 68.87,20.86 68.9,20.83 68.9,19.59 74.39,14.1 C27.2 | 68.87,22.29 68.8,22.35 v67.6,22.35 | v71.66,28.89 71.66,31.97 68.71,34.92 67.82,34.92
  Bottom 0.406: IA1.13 22.03,56.8 22.03,57.69 v21.56,58.26 | IA1.8 22.09,52.79 v21.81,52.01 | IA2.8 14.27,44.37 v14.1,44.04 | v32.96,61.44 33.34,60.67 IA3.13 | v33.4,55.34 33.4,56.48 IA3.8 | v44.13,51.02 44.13,51.15 44.48,51.5 44.48,52.26 IA4.8 | IA4.13 44.5,56.69 v43.99,57.17 | IA5.8 55.68,55.93 v55.15,55.24 | IA5.13 55.68,60.65 v55.21,61.4 | IA6.13 63.77,45.22 v64.48,45.69 | IA6.8 59.14,45.22 v58.21,45.74 58.21,51.93 v58.2,52.07 | IA7.8 58.88,30.81 v58.17,31.31 | IA7.13 63.8,30.81 v64.36,31.37 | v65.91,32.92 65.98,32.92 v67.88,34.89 | IA8.8 57.32,21.19 v57.94,21.4 | IA8.13 57.32,15.74 v57.78,15.33 | IA9.8 46.02,22.59 v46.48,23.59 | IA9.13 46.02,18.05 v46.59,17.13 46.74,17.02 48.48,17.02 49.56,15.94 v49.56,15.91 | IA10.8 35.35,18.68 v35.88,19.27 | IA10.13 35.35,14.05 v35.85,13.14 36.04,13.46 36.99,13.4 38.73,11.65 v41.43,9.11 | IA11.13 24.05,16.69 v24.61,15.91 | IA11.8 24.05,21.44 v24.56,22.24 | IA12.8 13.32,27.86 v13.94,27.34 | IA12.13 8.99,27.88 8.22,27.88 v7.75,27.4 | v15.05,12.13 6.06,21.05 v6.06,21.34 6.35,20.99 2.06,25.27 2.06,35.21 | v27.21,12.57 27.46,12.57 v31.08,8.95 | 2.06,35.21 2.06,37.94 JP2.2 | JP1.2 2.19,35.34 2.06,35.21 | IA2.13 8.46,44.37 v7.75,43.85 | v67.6,22.35 71.66,26.42 v71.66,28.89
I1+
  Top 0.406: J1.8 24.86,40.54 24.86,40.67 22.48,43.05 18.07,47.59 17.21,48.45 16.73,48.55 15.84,48.55 R6.1 15.75,48.39
I1-
  Top 0.406: J1.10 26.1,40.83 23.24,43.69 20.45,46.45 20.29,46.61 17.94,48.99 16.92,50.01 8.47,50.01 R5.1 8.32,50.16
I2+
  Top 0.406: J1.6 23.56,40.54 21.68,42.42 15.81,42.42 R7.1
I2-
  Top 0.406: J1.4 22.26,40.58 21.81,40.96 21.75,41.02 17.14,41.02 16.57,40.45 8.16,40.45 R8.1
I3+
  Top 0.406: R4.1 26.16,44.35 29.88,40.45 J1.16
I3-
  Top 0.406: R3.1 28.03,44.01 31.15,40.73 J1.18
I4+
  Top 0.406: R9.1 20.07,49.21 28.67,40.61 28.67,38.8 J1.14
I4-
  Top 0.406: R10.1 18.13,56.99 18.64,56.42 18.64,49.21 23.78,44.2 27.37,40.67 J1.12
I5+
  Top 0.406: R20.1 37.5,43.31 34.96,40.67 J1.24
I5-
  Top 0.406: 38.99,43.65 39.13,43.74 | 39.13,43.74 36.32,40.86 J1.26 | R19.1 39.4,59.08 39.08,58.77 39.12,43.97 39.13,43.74
I6+
  Top 0.406: R21.1 31.37,43.31 33.56,41.12 33.56,38.93 J1.22
I6-
  Top 0.406: R22.1 29.43,43.84 32.45,40.77 J1.20
I7+
  Top 0.406: R28.1 48.48,48.55 40,40.39 40.07,39.69 J1.32
I7-
  Top 0.406: R27.1 50.48,49.37 50.51,49.18 42.35,41.43 41.91,41.05 41.34,40.45 41.34,39.78 41.37,39.18 J1.34
I8+
  Top 0.406: J1.30 38.8,40.35 42.48,44.04 R29.1
I8-
  Top 0.406: J1.28 37.53,40.64 40.48,43.59 40.48,56.89 R30.1
I9+
  Top 0.406: R36.1 59.72,50.26 55.12,50.26 49.63,44.77 46.07,41.37 45.34,40.58 45.12,40.32 45.05,38.86 J1.40
I9-
  Top 0.406: R35.1 61.62,52.61 61.56,49.28 55.15,49.34 46.42,40.61 46.35,38.83 J1.42
I10+
  Top 0.406: R37.1 53.63,49.88 49.28,45.37 46.39,42.64 44.67,41.05 43.85,40.29 J1.38
I10-
  Top 0.406: J1.36 42.58,38.8 42.61,40 42.64,40.39 45.31,42.83 48.7,46.04 51.69,48.96 52.1,49.37 52.1,58.45 51.69,58.86 R38.1
I11+
  Top 0.406: R44.1 50.58,41.18 50.16,40.7 50.16,38.83 J1.48
I11-
  Top 0.406: R43.1 52.26,39.28 J1.50
I12+
  Top 0.406: R45.1 55.69,47.28 48.96,40.96 J1.46
I12-
  Top 0.406: J1.44 47.66,38.8 47.72,40.8 55.46,48.54 61.94,48.54 62.61,49.21 64.13,49.21 R46.1
I13+
  Top 0.406: R92.1 21.88,31.85 23.62,33.59 23.62,35.27 J1.5
I13-
  Top 0.406: R91.1 16.23,33.81 17.34,32.7 21.27,32.7 22.38,33.81 22.38,35.24 J1.3
I14+
  Top 0.406: R93.1 17.24,25.81 24.83,33.4 J1.7
I14-
  Top 0.406: R94.1 16.48,23.88 26.1,33.5 J1.9
I15+
  Top 0.406: R84.1 20,24.86 28.64,33.4 J1.13
I15-
  Top 0.406: R83.1 18.13,24.45 27.37,33.62 J1.11
I16+
  Top 0.406: R85.1 26.07,27.37 29.91,31.21 J1.15
I16-
  Top 0.406: R86.1 28.03,27.87 31.18,31.02 J1.17
I17+
  Top 0.406: R76.1 31.27,28.67 33.69,31.08 33.72,34.64 33.78,34.7 33.78,35.27 J1.21
I17-
  Top 0.406: R75.1 29.4,27.88 32.38,30.86 32.38,35.27 J1.19
I18+
  Top 0.406: R77.1 37.4,30.26 35.02,32.64 35.02,35.31 J1.23
I18-
  Top 0.406: R78.1 39.34,14.32 38.73,14.95 38.77,30.77 36.26,33.24 J1.25
I19+
  Top 0.406: R68.1 42,30.29 38.83,33.46 38.83,35.31 J1.29
I19-
  Top 0.406: R67.1 40.07,30.99 37.5,33.56 37.5,35.31 J1.27
I20+
  Top 0.406: R69.1 48.07,25.81 40,33.88 40,35.27 J1.31
I20-
  Top 0.406: R70.1 50.07,25.5 41.37,34.04 J1.33
I21+
  Top 0.406: R60.1 53.28,24.45 43.78,34.04 J1.37
I21-
  Top 0.406: R59.1 51.44,25.14 42.58,34 42.64,35.31 J1.35
I22+
  Top 0.406: R61.1 59.44,24.03 59.18,24.26 54.48,24.26 45.05,33.72 45.05,35.24 J1.39
I22-
  Top 0.406: R62.1 61.4,24.01 60.61,24.89 55.02,24.89 53.37,26.45 50.51,29.34 46.48,33.27 46.42,34.1 | 46.42,33.72 46.42,34.1 | 46.42,34.1 J1.41
I23+
  Top 0.406: R52.1 54.96,26.89 49.02,32.77 48.99,34.13 48.93,34.51 48.93,35.31 J1.45
I23-
  Top 0.406: R51.1 62.54,24.86 61.88,25.56 55.31,25.56 54.29,26.54 50.8,30 47.75,33.05 47.69,33.5 J1.43
I24+
  Top 0.406: R53.1 50.67,32.89 50.26,33.43 50.26,35.31 J1.47
I24-
  Top 0.406: R54.1 52.14,34.76 J1.49
IN1+  (via drill 0.6)
  Top 0.406: v12.29,48.48 13.88,48.48 R6.2
  Bottom 0.406: IA2.4 11.98,48.18 v12.29,48.48
IN1-  (via drill 0.6)
  Top 0.406: v9.59,48.45 8.51,48.48 R5.2
  Bottom 0.406: IA2.1 9.92,47.67 v9.59,48.45
IN2+  (via drill 0.6)
  Top 0.406: v12.29,42.07 13.62,42.13 R7.2
  Bottom 0.406: IA2.9 11.86,42.91 v12.29,42.07
IN2-  (via drill 0.6)
  Top 0.406: v9.52,42.16 8.16,42.16 R8.2
  Bottom 0.406: IA2.12 9.94,43.48 v9.52,42.16
IN3+  (via drill 0.6)
  Top 0.406: v26.07,53.78 26.13,52.7 R4.2
  Bottom 0.406: IA1.4 25.51,54.18 v26.07,53.78
IN3-  (via drill 0.6)
  Top 0.406: v26.1,56.42 26.1,58.35 R3.2
  Bottom 0.406: IA1.1 25.51,56.11 v26.1,56.42
IN4+  (via drill 0.6)
  Top 0.406: v20.03,53.85 20.03,52.54 R9.2
  Bottom 0.406: IA1.9 20.5,54.18 v20.03,53.85
IN4-  (via drill 0.6)
  Top 0.406: v20.03,56.45 20.13,57.78 R10.2
  Bottom 0.406: IA1.12 20.37,56.11 v20.03,56.45
IN5+  (via drill 0.6)
  Top 0.406: v37.85,57.09 37.85,55.78 R20.2
  Bottom 0.406: IA3.4 37.03,57.45 v37.85,57.09
IN5-  (via drill 0.6)
  Top 0.406: 37.34,59.63 v37.85,59.69 37.97,59.82 37.53,61.18 R19.2
  Bottom 0.406: IA3.1 36.94,59.38 v37.85,59.69
IN6+  (via drill 0.6)
  Top 0.406: v31.24,57.09 31.24,55.75 R21.2
  Bottom 0.406: IA3.9 32.05,57.45 v31.24,57.09
IN6-  (via drill 0.6)
  Top 0.406: v31.21,59.75 31.24,61.08 R22.2
  Bottom 0.406: IA3.12 31.86,59.38 v31.21,59.75
IN7+  (via drill 0.6)
  Top 0.406: v48.99,52.83 49.02,51.43 R28.2
  Bottom 0.406: IA4.4 47.99,53.17 v48.99,52.83
IN7-  (via drill 0.6)
  Top 0.406: v48.93,55.4 48.61,56.67 R27.2
  Bottom 0.406: IA4.1 47.83,55.1 v48.93,55.4
IN8+  (via drill 0.6)
  Top 0.406: v42.13,52.83 42.13,51.31 R29.2
  Bottom 0.406: IA4.9 42.85,53.17 v42.13,52.83
IN8-  (via drill 0.6)
  Top 0.406: v42.13,55.5 42.2,56.67 R30.2
  Bottom 0.406: IA4.12 42.98,55.1 v42.13,55.5
IN9+  (via drill 0.6)
  Top 0.406: v60.07,56.99 60.1,55.43 R36.2
  Bottom 0.406: IA5.4 59.29,57.36 v60.07,56.99
IN9-  (via drill 0.6)
  Top 0.406: v59.88,59.66 59.88,61.02 R35.2
  Bottom 0.406: IA5.1 59.42,59.29 v59.88,59.66
IN10+  (via drill 0.6)
  Top 0.406: v53.21,56.99 53.24,55.53 R37.2
  Bottom 0.406: IA5.9 54.09,57.36 v53.21,56.99
IN10-  (via drill 0.6)
  Top 0.406: v53.24,59.63 53.31,61.24 R38.2
  Bottom 0.406: IA5.12 54.03,59.29 v53.24,59.63
IN11+  (via drill 0.6)
  Top 0.406: v60.13,41.08 58.96,41.12 R44.2
  Bottom 0.406: IA6.4 60.47,41.96 v60.13,41.08
IN11-  (via drill 0.6)
  Top 0.406: v62.77,41.08 64.16,41.12 R43.2
  Bottom 0.406: IA6.1 62.4,42.34 62.52,42.23 62.52,41.85 v62.77,41.08
IN12+  (via drill 0.6)
  Top 0.406: v60.13,47.43 58.89,47.4 R45.2
  Bottom 0.406: IA6.9 60.41,46.78 v60.13,47.43
IN12-  (via drill 0.6)
  Top 0.406: v62.74,47.43 64.16,47.4 R46.2
  Bottom 0.406: IA6.12 62.4,46.62 v62.74,47.43
IN13+  (via drill 0.6)
  Top 0.406: v12.13,32.26 R92.2
  Bottom 0.406: IA12.4 11.82,31.38 v12.13,32.26
IN13-  (via drill 0.6)
  Top 0.406: v9.56,32.23 8.29,32.19 R91.2
  Bottom 0.406: IA12.1 9.89,31.38 v9.56,32.23
IN14+  (via drill 0.6)
  Top 0.406: v12.13,25.72 13.15,25.84 R93.2
  Bottom 0.406: IA12.9 11.82,26.37 v12.13,25.72
IN14-  (via drill 0.6)
  Top 0.406: v9.52,25.78 8.23,25.78 R94.2
  Bottom 0.406: IA12.12 9.89,26.28 v9.52,25.78
IN15+  (via drill 0.6)
  Top 0.406: v19.88,20.42 19.88,21.59 R84.2
  Bottom 0.406: IA11.4 20.62,20.08 v19.88,20.42
IN15-  (via drill 0.6)
  Top 0.406: v19.91,17.84 19.91,16.58 R83.2
  Bottom 0.406: IA11.1 20.56,18.15 v19.91,17.84
IN16+  (via drill 0.6)
  Top 0.406: v26.16,20.45 26.16,21.69 R85.2
  Bottom 0.406: IA11.9 25.48,20.08 v26.16,20.45
IN16-  (via drill 0.6)
  Top 0.406: v26.16,17.84 26.19,16.67 R86.2
  Bottom 0.406: IA11.12 25.67,18.15 v26.16,17.84
IN17+  (via drill 0.6)
  Top 0.406: v31.24,17.49 31.24,18.73 R76.2
  Bottom 0.406: IA10.4 31.9,17.16 v31.24,17.49
IN17-  (via drill 0.6)
  Top 0.406: v31.24,14.89 31.27,13.59 R75.2
  Bottom 0.406: IA10.1 31.77,15.23 v31.24,14.89
IN18+  (via drill 0.6)
  Top 0.406: v37.56,17.49 37.56,18.86 R77.2
  Bottom 0.406: IA10.9 37,17.16 v37.56,17.49
IN18-  (via drill 0.6)
  Top 0.406: v37.59,14.92 37.62,13.69 R78.2
  Bottom 0.406: IA10.12 36.91,15.23 v37.59,14.92
IN19+  (via drill 0.6)
  Top 0.406: v41.91,21.65 41.91,22.86 R68.2
  Bottom 0.406: IA9.4 42.69,21.28 v41.91,21.65
IN19-  (via drill 0.6)
  Top 0.406: v41.97,19.02 42,17.69 R67.2
  Bottom 0.406: IA9.1 42.66,19.35 v41.97,19.02
IN20+  (via drill 0.6)
  Top 0.406: v48.23,21.65 48.23,23.18 R69.2
  Bottom 0.406: IA9.9 47.54,21.28 v48.23,21.65
IN20-  (via drill 0.6)
  Top 0.406: v48.23,19.05 48.23,17.69 R70.2
  Bottom 0.406: IA9.12 47.54,19.35 v48.23,19.05
IN21+  (via drill 0.6)
  Top 0.406: v53.31,19.62 53.31,21.02 R60.2
  Bottom 0.406: IA8.4 53.71,19.32 v53.31,19.62
IN21-  (via drill 0.6)
  Top 0.406: v53.31,17.08 53.47,15.69 R59.2
  Bottom 0.406: IA8.1 53.74,17.39 v53.31,17.08
IN22+  (via drill 0.6)
  Top 0.406: v59.5,19.62 59.5,21.12 R61.2
  Bottom 0.406: IA8.9 59.1,19.32 v59.5,19.62
IN22-  (via drill 0.6)
  Top 0.406: v59.47,16.99 59.5,15.59 R62.2
  Bottom 0.406: IA8.12 58.94,17.39 v59.47,16.99
IN23+  (via drill 0.6)
  Top 0.406: v59.91,26.54 58.89,27.15 R52.2
  Bottom 0.406: IA7.4 60.34,27.29 v59.91,26.54
IN23-  (via drill 0.6)
  Top 0.406: v62.67,26.61 63.78,27.11 R51.2
  Bottom 0.406: IA7.1 62.27,27.36 v62.67,26.61
IN24+  (via drill 0.6)
  Top 0.406: v59.98,33.24 58.64,33.18 R53.2
  Bottom 0.406: IA7.9 60.09,32.84 v59.98,33.24
IN24-  (via drill 0.6)
  Top 0.406: v62.58,33.24 63.88,33.21 R54.2
  Bottom 0.406: IA7.12 62.27,32.33 v62.58,33.24
N$2
  Top 0.406: U1.8 68.15,3.87 C2.1
O1
  Bottom 0.406: R15.2 4.26,50.99 23.78,70.9 68.14,70.9 79.95,58.86 X2.20 | 86.49,58.86 X2.20 | X2.20
O2
  Bottom 0.406: R16.2 2.79,44.35 2.73,44.29 2.73,50.93 23.18,71.56 68.52,71.56 79.76,60.26 83.29,60.26 X2.1
O3
  Bottom 0.406: R13.2 24.1,63.47 29.94,69.53 66.9,69.5 81.5,54.77 X2.3
O4
  Bottom 0.406: R14.2 22.07,62.64 29.4,70.2 67.66,70.17 81.66,56.07 85.6,56.07 86.07,55.59 86.07,55.88 X2.21
O5
  Bottom 0.406: R23.2 35.21,67.15 36.16,68.2 65.12,68.2 70.2,62.86 73.91,58.93 80.9,51.94 83.29,51.94 X2.4
O6
  Bottom 0.406: R24.2 33.21,66.42 35.4,68.87 66.26,68.87 81.47,53.37 X2.22
O7
  Bottom 0.406: R31.2 46.51,64.74 47.34,65.72 47.47,65.75 48.2,66.77 62.32,66.83 66.07,62.71 71.98,56.45 80.68,47.82 X2.24
O8
  Bottom 0.406: R32.2 44.48,64.2 47.59,67.5 63.31,67.5 67.53,62.74 72.39,57.78 80.96,49.21 83.29,49.21 X2.5
O9
  Bottom 0.406: X2.25 79.82,45.05 69.31,55.56 64.86,60.07 60.58,64.67 57.69,64.71 R39.2
O10
  Bottom 0.406: R40.2 55.63,66.17 60.8,66.17 80.45,46.42 83.28,46.42 X2.6
O11
  Bottom 0.406: R47.2 68.45,43.31 70.83,40.93 83.3,40.93 X2.8
O12
  Bottom 0.406: R48.2 68.36,45.31 71.34,42.32 85.84,42.32 X2.26
O13
  Bottom 0.406: R95.2 2.83,29.88 | 2.83,29.88 2.83,29.91 | 2.83,29.88 2.83,26.42 25.84,3.37 65.94,3.37 82.8,20.22 85.84,20.22 X2.34
O14
  Bottom 0.406: R96.2 4.51,26.64 26.7,4.44 65.15,4.44 82.33,21.62 83.27,21.62 X2.15
O15
  Bottom 0.406: R87.2 22.07,11.91 28.57,5.4 64.58,5.4 79.25,20.07 79.25,21.3 82.23,24.38 83.28,24.38 X2.14
O16
  Bottom 0.406: R88.2 24.38,12.83 30.96,6.25 63.91,6.25 77.79,20.13 77.76,21.15 82.07,25.72 X2.32
O17
  Bottom 0.406: R79.2 33.4,7.08 63.31,7.08 76.55,20.32 76.55,21.18 82.26,27.15 83.29,27.15 X2.13
O18
  Bottom 0.406: R80.2 35.43,9.65 37.02,8.06 62.9,8.06 74.61,19.78 74.61,20.64 82.3,28.51 85.83,28.51 X2.31
O19
  Bottom 0.406: R71.2 44.07,13.02 47.85,8.95 62.26,8.95 72.99,19.65 72.99,21.56 82.39,31.24 85.83,31.24 X2.30
O20
  Bottom 0.406: R72.2 46.16,12.29 48.61,9.75 61.69,9.75 71.75,19.81 71.75,21.72 82.26,32.64 X2.11
O21
  Bottom 0.406: R63.2 55.31,10.51 61.28,10.51 70.33,19.72 70.33,21.84 82.3,33.97 85.79,33.97 X2.29
O22
  Bottom 0.406: R64.2 61.22,11.91 69.31,20 69.31,22.19 82.3,35.31 83.25,35.34 X2.10
O23
  Bottom 0.406: R55.2 68.51,28.76 77.95,38.19 83.29,38.19 X2.9
O24
  Bottom 0.406: R56.2 67.66,31.33 75.88,39.56 85.83,39.56 X2.27
OUT1
  Bottom 0.406: IA2.15 7.06,45.67 R15.1
OUT2
  Bottom 0.406: IA2.14 7.03,45.01 R16.1
OUT3
  Bottom 0.406: IA1.15 23.38,58.94 R13.1
OUT4
  Bottom 0.406: IA1.14 22.72,59.01 R14.1
OUT5
  Bottom 0.406: IA3.15 34.78,62.47 R23.1
OUT6
  Bottom 0.406: IA3.14 34.12,62.24 R24.1
OUT7
  Bottom 0.406: IA4.15 45.8,57.9 R31.1
OUT8
  Bottom 0.406: IA4.14 45.14,57.96 R32.1
OUT9
  Bottom 0.406: IA5.15 56.97,62.09 R39.1
OUT10
  Bottom 0.406: IA5.14 56.31,62.18 R40.1
OUT11
  Bottom 0.406: IA6.15 65.29,43.93 R47.1
OUT12
  Bottom 0.406: IA6.14 65.17,44.59 R48.1
OUT13
  Bottom 0.406: IA12.15 7.13,29.16 R95.1
OUT14
  Bottom 0.406: IA12.14 7.06,28.5 R96.1
OUT15
  Bottom 0.406: IA11.15 22.75,14.65 R87.1
OUT16
  Bottom 0.406: IA11.14 23.41,14.88 R88.1
OUT17
  Bottom 0.406: IA10.15 34.05,12.4 R79.1
OUT18
  Bottom 0.406: IA10.14 34.72,12.43 R80.1
OUT19
  Bottom 0.406: IA9.15 44.72,16.49 R71.1
OUT20
  Bottom 0.406: IA9.14 45.38,16.56 R72.1
OUT21
  Bottom 0.406: IA8.15 56.03,14.53 R63.1
OUT22
  Bottom 0.406: IA8.14 56.69,14.49 R64.1
OUT23
  Bottom 0.406: IA7.15 64.98,29.51 R55.1
OUT24
  Bottom 0.406: IA7.14 65.07,30.17 R56.1
RG1
  Bottom 0.406: IA2.3 11.22,49.26 R11.1
RG1_2
  Bottom 0.406: IA2.2 10.56,49.32 R11.2
RG2
  Bottom 0.406: IA2.11 10.56,40.97 R12.1
RG2_2
  Bottom 0.406: IA2.10 11.22,40.85 R12.2
RG3
  Bottom 0.406: IA1.3 27,54.82 R1.1
RG3_2
  Bottom 0.406: IA1.2 26.94,55.48 R1.2
RG4
  Bottom 0.406: IA1.11 19.23,55.48 R2.1
RG4_2
  Bottom 0.406: IA1.10 19.03,54.82 R2.2
RG5
  Bottom 0.406: IA3.3 38.91,58.09 R17.1
RG5_2
  Bottom 0.406: IA3.2 38.91,58.75 R17.2
RG6
  Bottom 0.406: IA3.11 30.05,58.75 R18.1
RG6_2
  Bottom 0.406: IA3.10 30.12,58.06 R18.2
RG7
  Bottom 0.406: IA4.3 49.83,53.8 R25.1
RG7_2
  Bottom 0.406: IA4.2 49.96,54.46 R25.2
RG8
  Bottom 0.406: IA4.11 41.07,54.46 R26.1
RG8_2
  Bottom 0.406: IA4.10 41.13,53.8 R26.2
RG9
  Bottom 0.406: IA5.3 60.97,57.99 R33.1
RG9_2
  Bottom 0.406: IA5.2 61.29,58.65 R33.2
RG10
  Bottom 0.406: IA5.11 52.12,58.65 R34.1
RG10_2
  Bottom 0.406: IA5.10 52.37,57.99 R34.2
RG11
  Bottom 0.406: IA6.3 61.11,40.34 R41.1
RG11_2
  Bottom 0.406: IA6.2 61.86,40.21 R41.2
RG12
  Bottom 0.406: IA6.11 61.77,48.31 R42.1
RG12_2
  Bottom 0.406: IA6.10 61.07,48.34 R42.2
RG13
  Bottom 0.406: IA12.3 11.19,33.32 R89.1
RG13_2
  Bottom 0.406: IA12.2 10.53,33.23 R89.2
RG14
  Bottom 0.406: IA12.11 10.53,24.84 R90.1
RG14_2
  Bottom 0.406: IA12.10 11.19,24.84 R90.2
RG15
  Bottom 0.406: IA11.3 19.1,19.44 R81.1
RG15_2
  Bottom 0.406: IA11.2 18.91,18.78 R81.2
RG16
  Bottom 0.406: IA11.11 27.19,18.78 R82.1
RG16_2
  Bottom 0.406: IA11.10 26.94,19.44 R82.2
RG17
  Bottom 0.406: IA10.3 30.21,16.52 R73.1
RG17_2
  Bottom 0.406: IA10.2 30.27,15.86 R73.2
RG18
  Bottom 0.406: IA10.11 38.53,15.86 R74.1
RG18_2
  Bottom 0.406: IA10.10 38.4,16.52 R74.2
RG19
  Bottom 0.406: IA9.3 41.07,20.65 R65.1
RG19_2
  Bottom 0.406: IA9.2 41.01,19.99 R65.2
RG20
  Bottom 0.406: IA9.11 49.16,19.99 R66.1
RG20_2
  Bottom 0.406: IA9.10 49.1,20.65 R66.2
RG21
  Bottom 0.406: IA8.3 52.37,18.68 R57.1
RG21_2
  Bottom 0.406: IA8.2 52.37,18.02 R57.2
RG22
  Bottom 0.406: IA8.11 60.31,18.02 R58.1
RG22_2
  Bottom 0.406: IA8.10 60.44,18.68 R58.2
RG23
  Bottom 0.406: IA7.3 60.98,25.26 R49.1
RG23_2
  Bottom 0.406: IA7.2 61.64,25.32 R49.2
RG24
  Bottom 0.406: IA7.11 61.64,34.08 R50.1
RG24_2
  Bottom 0.406: IA7.10 60.98,34.08 R50.2
V+
  Top 0.406: U$3.7 69.94,15.81 L1.1 69.91,13.33 C27.1
VCC  (via drill 0.6)
  Top 0.406: 14.29,46.29 v14.13,46.32 | v14.13,46.32 13.33,47.15 8.51,47.15 C6.1 6.25,46.67 v7.68,46.86 | v24.54,58.23 24.22,58.51 C4.1 24.86,57.62 24.86,52.48 24,51.62 C3.1 24.07,51.46 v24.26,51.94 | v35.91,61.47 35.78,62.04 C8.1 36.13,61.24 36.13,56.04 35.37,55.28 v35.34,55.28 35.37,55.25 C7.1 | v46.96,50.93 46.86,51.24 | 46.86,51.24 46.39,50.77 46.39,49.4 C9.1 | 46.86,51.24 46.86,51.59 47.18,51.91 47.18,56.64 v46.96,57.18 46.42,57.41 C10.1 46.51,58.77 46.51,60.23 43.5,63.25 v42.45,63.25 | C11.1 57.94,54.42 v58.07,55.28 58.07,55.69 58.36,55.98 58.36,60.93 58.1,61.18 v58.17,61.4 57.66,61.53 C12.1 | v59.53,63.02 56.48,66.93 v36.96,66.96 v29.5,66.96 22.73,66.96 v22.7,66.93 | C13.1 57.6,42.86 v58.23,42.77 58.77,42.61 59.28,42.51 63.91,42.51 v64.52,42.8 64.29,42.86 64.71,43.27 66.04,43.27 C14.1 | v67.98,47.5 67.98,44.01 67.21,43.24 66.07,43.24 C14.1 | 57.09,28.48 v58.2,28.38 58.77,28.19 63.91,28.19 64.17,28.45 v64.36,28.32 64.29,28.64 65.53,28.64 65.69,28.8 C16.1 65.85,28.89 66.8,28.89 67.69,29.78 67.69,32.8 66.04,34.45 C14.1 | 57.09,28.48 C15.1 | C18.1 55.22,14.98 v54.9,15.3 55.05,15.46 54.86,15.65 54.86,21.08 55.05,21.27 v54.83,21.4 55.09,21.65 55.31,22.95 C17.1 | C19.1 44.04,24.7 44.04,23.49 43.85,23.37 v43.72,23.56 43.31,23.15 43.31,17.62 43.56,17.37 43.66,17.21 v43.67,17.16 44.13,17.14 C20.1 44.13,10.57 44.26,10.38 | 44.26,10.38 48.61,10.38 v48.61,14.51 | C21.1 33.08,20.38 v32.96,19.43 33.05,18.92 32.73,18.61 32.73,13.65 v32.96,13.14 33.31,13.08 33.31,11.94 C22.1 33.46,11.78 33.46,10.38 | 44.26,10.38 33.46,10.38 | C23.1 22.1,23.75 22.07,22.92 v21.51,22.3 21.46,21.75 21.46,16.16 v21.59,15.91 21.88,15.05 C24.1
  Top 0.406: 14.45,30.26 v14,30.29 | v14,30.29 13.37,30.51 8.13,30.61 v7.75,30.38 7.05,29.78 C26.1 6.38,29.84 5.05,29.84 4.03,28.83 | C25.1 15.24,30.29 v14,30.29 | 33.46,10.38 25.53,10.38 22.13,13.78 22.13,14.79 C24.1 | C24.1 11.18,14.35 3.97,21.59 3.97,28.77 4.03,28.83 | v65.34,18.48 65.35,16.31 65.35,16.02 65.37,16 65.37,10.64 | 57.09,28.48 55.15,28.48 v55.02,28.61 | L1.2 70.26,10.79 C28.1 | v72.52,7.84 71.21,7.84 69.94,9.11 L1.2 | L1.2 69.88,10.64 65.37,10.64 | 65.37,10.64 63.98,10.64 63.12,9.78 U1.3 | C5.1 15.62,46.32 v14.13,46.32 | C1.1 v77.22,5.49 | 4.03,28.83 v4.03,32.42 | v4.1,42.26 4.16,42.32 4.16,45.97 4.48,46.29 6.19,46.29
  Bottom 0.406: IA1.16 24.14,57 24,56.9 24,57.91 v24.54,58.23 | IA1.5 24.05,52.41 v24.26,51.94 | IA2.16 9.04,46.4 9.24,46.32 8.45,46.32 v7.68,46.86 7.84,46.8 | IA2.5 12.76,46.32 v14.13,46.32 14.29,46.29 14.35,46.32 | IA3.16 35.91,61.02 v35.91,61.47 37.08,61.09 | v35.34,55.28 35.4,55.44 IA3.5 | v46.96,57.18 46.8,56.36 IA4.16 | IA4.5 46.43,51.74 v46.96,50.93 | v36.96,66.96 37.08,61.09 | IA5.5 57.61,56.03 v58.07,55.28 58.61,55.02 64.86,55.02 67.98,51.91 v67.98,47.5 | IA5.16 57.61,60.78 v58.17,61.4 58.07,61.12 59.59,61.12 59.56,61.15 v59.53,63.02 | IA6.5 59.23,43.29 v58.23,42.77 | IA6.16 63.83,43.29 v64.52,42.8 | IA7.5 58.88,28.88 v58.2,28.38 | IA7.16 63.8,28.88 v64.36,28.32 64.04,28.38 64.04,26.92 65.34,25.62 v65.34,18.48 | IA8.5 55.37,20.25 55.37,20.92 v54.83,21.4 55.02,21.34 v55.02,28.61 | IA8.16 55.39,15.77 v54.9,15.3 v48.61,14.51 | IA9.5 44.09,22.84 v43.72,23.56 | IA9.16 44.09,17.83 v43.67,17.16 | IA10.5 33.42,18.59 v32.96,19.43 | IA10.16 33.42,13.89 v32.96,13.14 | IA11.16 22.12,16.78 v21.59,15.91 | IA11.5 22.12,21.44 v21.51,22.3 | IA12.5 13.32,29.79 v14,30.29 | v7.75,30.38 8.41,29.81 8.99,29.81 IA12.16 | v29.5,66.96 29.4,61.79 25.56,58.13 v24.54,58.23 | 24.38,58.13 v24.54,58.23 | v22.7,66.93 22.42,66.71 14.32,58.83 14.32,46.35 14.35,46.32 | 14.35,46.32 14.35,46.26 | 37.08,61.09 40.35,61.15 v42.45,63.25 | v77.22,5.49 74.8,7.84 v72.52,7.84 | 4.1,32.48 v4.03,32.42 5.97,32.42 7.97,34.42 7.97,39.62 5.46,42.13 4.22,42.13 v4.1,42.26
VREF  (via drill 0.6)
  Top 0.406: U1.1 68.31,6.73 73.28,6.73 75.34,8.79 v75.34,8.99 | v79.47,13.3 76.93,13.33 71.95,18.45 71.95,23.24 71.98,23.59 71.98,25.49 70.68,26.61 66.17,26.61 65.82,26.26 65.82,23.59 64.74,22.51 v63.5,22.51
  Bottom 0.406: IA1.6 IA1.7 22.9,53.3 22.95,53.24 22.95,50.67 23.05,43.62 | 13.14,45.28 IA2.6 IA2.7 12.95,45.21 16.73,45.21 18.1,43.62 23.05,43.62 | IA3.6 IA3.7 34.38,56.57 34.35,43.59 | 34.35,43.59 23.62,43.62 23.05,43.62 | IA4.7 45.45,52.28 | 45.45,52.28 IA4.6 | 45.45,52.28 45.45,44.47 45.5,43.5 | 45.5,43.5 34.35,43.59 | IA5.6 IA5.7 56.93,55.85 56.86,43.47 | 45.5,43.5 56.86,43.5 | 56.86,43.5 56.96,43.47 56.86,43.47 | IA6.6 IA6.7 57.96,44.59 56.86,43.47 | IA7.6 59.45,29.86 | 59.45,29.86 IA7.7 | 59.45,29.86 57.42,29.86 57.37,29.91 | 57.37,29.91 56.93,29.97 | 56.93,29.97 56.93,43.43 56.86,43.5 | IA8.6 IA8.7 56.69,22.42 | 56.69,22.42 56.69,22.65 56.67,29.94 57.34,29.94 57.37,29.91 | IA9.6 45.04,22.17 | 45.04,22.17 IA9.7 | 45.04,22.17 45.01,29.61 | 45.01,29.61 45.12,29.84 56.93,29.97 | IA10.6 34.35,18.05 | 34.35,18.05 IA10.7 | 34.35,18.05 34.35,29.52 34.48,29.84 | 34.48,29.84 34.29,29.81 44.84,29.81 45.01,29.61 | IA11.6 IA11.7 23.4,20.98 23.4,29.62 23.65,29.81 | X2.18 v79.47,13.3 79.69,13.33 v75.34,8.99 | v63.5,22.51 56.78,22.51 56.69,22.42 | 34.48,29.84 23.62,29.84 23.65,29.81 | 23.65,29.81 17.05,29.81 15.94,28.7 13.17,28.7 IA12.6 IA12.7